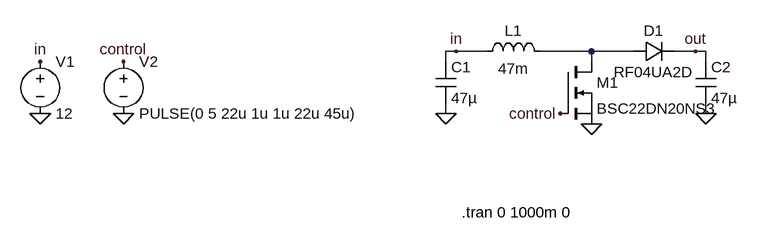
[diagram p0: schematic boost.asc]
boost.asc, the LTspice schematic file:
Version 4
SHEET 1 880 680
WIRE 128 208 112 208
WIRE 176 208 128 208
WIRE 336 208 256 208
WIRE 400 208 336 208
WIRE 496 208 464 208
WIRE 512 208 496 208
WIRE 112 224 112 208
WIRE 336 224 336 208
WIRE 512 224 512 208
WIRE 112 304 112 288
WIRE 512 304 512 288
FLAG 512 304 0
FLAG 336 320 0
FLAG 112 304 0
FLAG -512 304 0
FLAG -512 224 in
FLAG 128 208 in
FLAG 496 208 out
FLAG -384 304 0
FLAG -384 224 control
FLAG 288 304 control
SYMBOL cap 96 224 R0
SYMATTR InstName C1
SYMATTR Value 47µ
SYMBOL cap 496 224 R0
SYMATTR InstName C2
SYMATTR Value 47µ
SYMBOL ind 160 224 R270
WINDOW 0 32 56 VTop 2
WINDOW 3 5 56 VBottom 2
SYMATTR InstName L1
SYMATTR Value 47m
SYMBOL nmos 288 224 R0
SYMATTR InstName M1
SYMATTR Value BSC22DN20NS3
SYMBOL diode 400 224 R270
WINDOW 0 32 32 VTop 2
WINDOW 3 0 32 VBottom 2
SYMATTR InstName D1
SYMATTR Value RF04UA2D
SYMATTR Description Schottky diode
SYMATTR Type schottky
SYMBOL voltage -512 208 R0
SYMATTR InstName V1
SYMATTR Value 12
SYMBOL voltage -384 208 R0
WINDOW 123 0 0 Left 0
WINDOW 39 0 0 Left 0
SYMATTR InstName V2
SYMATTR Value PULSE(0 5 22u 1u 1u 22u 45u)
TEXT 136 456 Left 2 !.tran 0 1000m 0

The netlist it stands for:
* boost.asc
C1 in 0 47µ
C2 out 0 47µ
L1 in N001 47m
M1 N001 control 0 0 BSC22DN20NS3
D1 N001 out RF04UA2D
V1 in 0 12
V2 control 0 PULSE(0 5 22u 1u 1u 22u 45u)
.model D D
.lib standard.dio
.model NMOS NMOS
.model PMOS PMOS
.lib standard.mos
.tran 0 1000m 0
.backanno
.end